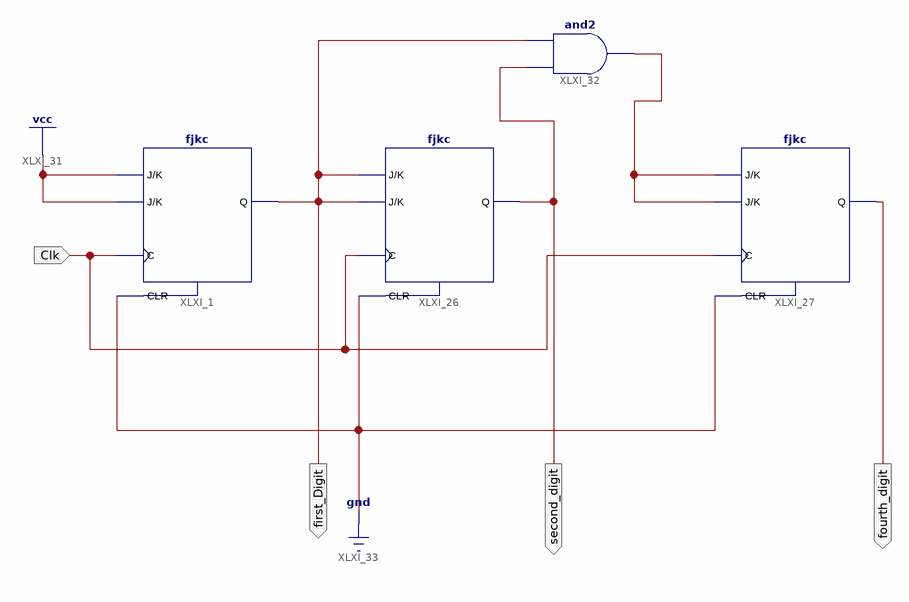
[diagram p0: schematic sheet 1]
// Xilinx ISE schematic mod8.sch (spartan6) as structural Verilog: 4 symbols, 4 ports
module mod8 (
  input  Clk,
  output first_Digit,
  output second_digit,
  output fourth_digit
);

  wire XLXN_28;

  fjkc XLXI_1 (.C(Clk), .CLR(1'b0), .J(1'b1), .K(1'b1), .Q(first_Digit));
  fjkc XLXI_26 (.C(Clk), .CLR(1'b0), .J(first_Digit), .K(first_Digit), .Q(second_digit));
  fjkc XLXI_27 (.C(Clk), .CLR(1'b0), .J(XLXN_28), .K(XLXN_28), .Q(fourth_digit));
  and XLXI_32 (XLXN_28, second_digit, first_Digit);
endmodule
